# Altium schematic sheet PMOD_DPOT.SchDoc
size A4; SheetNumber: 1; SheetTotal: 1
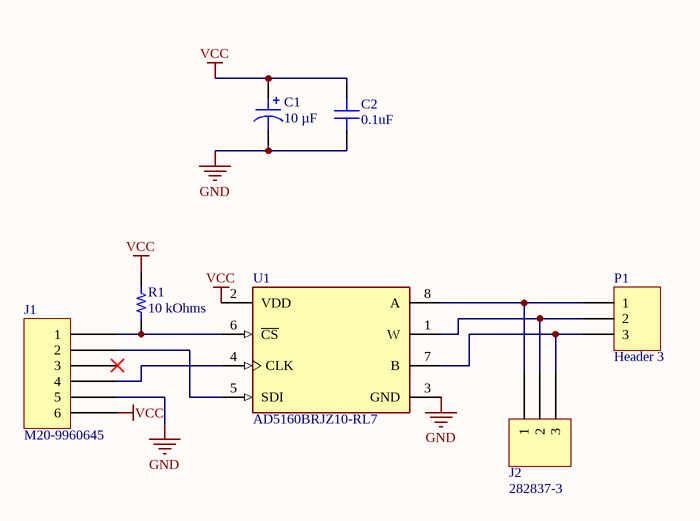
[diagram p0: PMOD_DPOT.SchDoc]

## Parts
C1  10 µF  [CAP POL 1411_3528]
C2  0.1uF  [CAP 0805_2012]
J1  M20-9960645  [HARWIN M20-9960645]
J2  282837-3  [TE 282837-3]
P1  Header 3  [HDR1X3]
R1  10 kOhms  [RES 0805_2012]
U1  AD5160BRJZ10-RL7  [FP-RJ-8-IPC_A]

## Nets
GND: C1.2 C2.2 J1.5 U1.3(GND)
VCC: C1.1 C2.1 J1.6 R1.2 U1.2(VDD)
NetJ1_1: J1.1 R1.1 U1.6(~{CS})
NetJ1_2: J1.2 U1.5(SDI)
NetJ1_4: J1.4 U1.4(CLK)
NetJ2_1: J2.1 P1.1 U1.8(A)
NetJ2_2: J2.2 P1.2 U1.1(W)
NetJ2_3: J2.3 P1.3 U1.7(B)

Not connected (* = marked no-connect by the designer): J1 3*

## Library data of the parts
C1 = TMCRB1C106MTRF: CAP TANT 10UF 20% 16V 1411; Part Number: TMCRB1C106MTRF; Value: 10 µF
C2 = C2012X7R0J106K125AB: CAP CER 10UF 6.3V X7R 0805; Value: 10 µF; Part Number: C2012X7R0J106K125AB
J1 = M20-9960645: CONN HEADER R/A 6POS 2.54MM; Part Number: M20-9960645
J2 = 282837-3: TERM BLK 3P SIDE ENT 5.08MM PCB; Part Number: 282837-3
P1 = Header 3: Header, 3-Pin; LatestRevisionDate: 17-Jul-2002; LatestRevisionNote: Re-released for DXP Platform.; Publisher: Altium Limited
R1 = TNPU080510K0AWEN00: TNPU0805 10K 0.05% 2PPM E52 E3; Part Number: TNPU080510K0AWEN00; Value: 10 kOhms
U1 = CMP-09083-000016-1: IC DGT POT 10KOHM 256TAP SOT23-8; Number of Elements: 1; Number of Taps: 256; -3db Bandwidth: 1.2MHz; Nominal Supply Current: 3uA; Operating Supply Voltage: 5.5V; Interface: SPI; Resistance Tolerance: 15%; Frequency: 25MHz; Resistance: 10kR; Temperature Coefficient: 35ppm/°C; Min Supply Voltage: 2.7V; Memory Type: Volatile; Mount: Surface Mount; Package Quantity: 1; Taper: Linear; Series: -; Number of Circuits: 1; Number of Channels: 1; Lead Free: Contains Lead; Number of Pins: 8; Number of Positions: 256; Supply Current: 3uA; Min Operating Temperature: -40°C; Quiescent Current: 3uA; Packaging: Tape and Reel; Max Supply Current: 3uA; Operating Supply Current: 3uA; REACH SVHC: No SVHC; Case/Package: SOT-23; Contact Plating: Gold; Termination: SMD/SMT; RoHS Compliant: Yes; Tolerance: 15%; Max Supply Voltage: 5.5V; Radiation Hardening: No; Max Operating Temperature: 125°C